# EAGLE design pirShield (EAGLE 7.2.0)
CNAME: Final Year Project; CREVISION: 1.0; DESIGNER: Adil Benabdallah
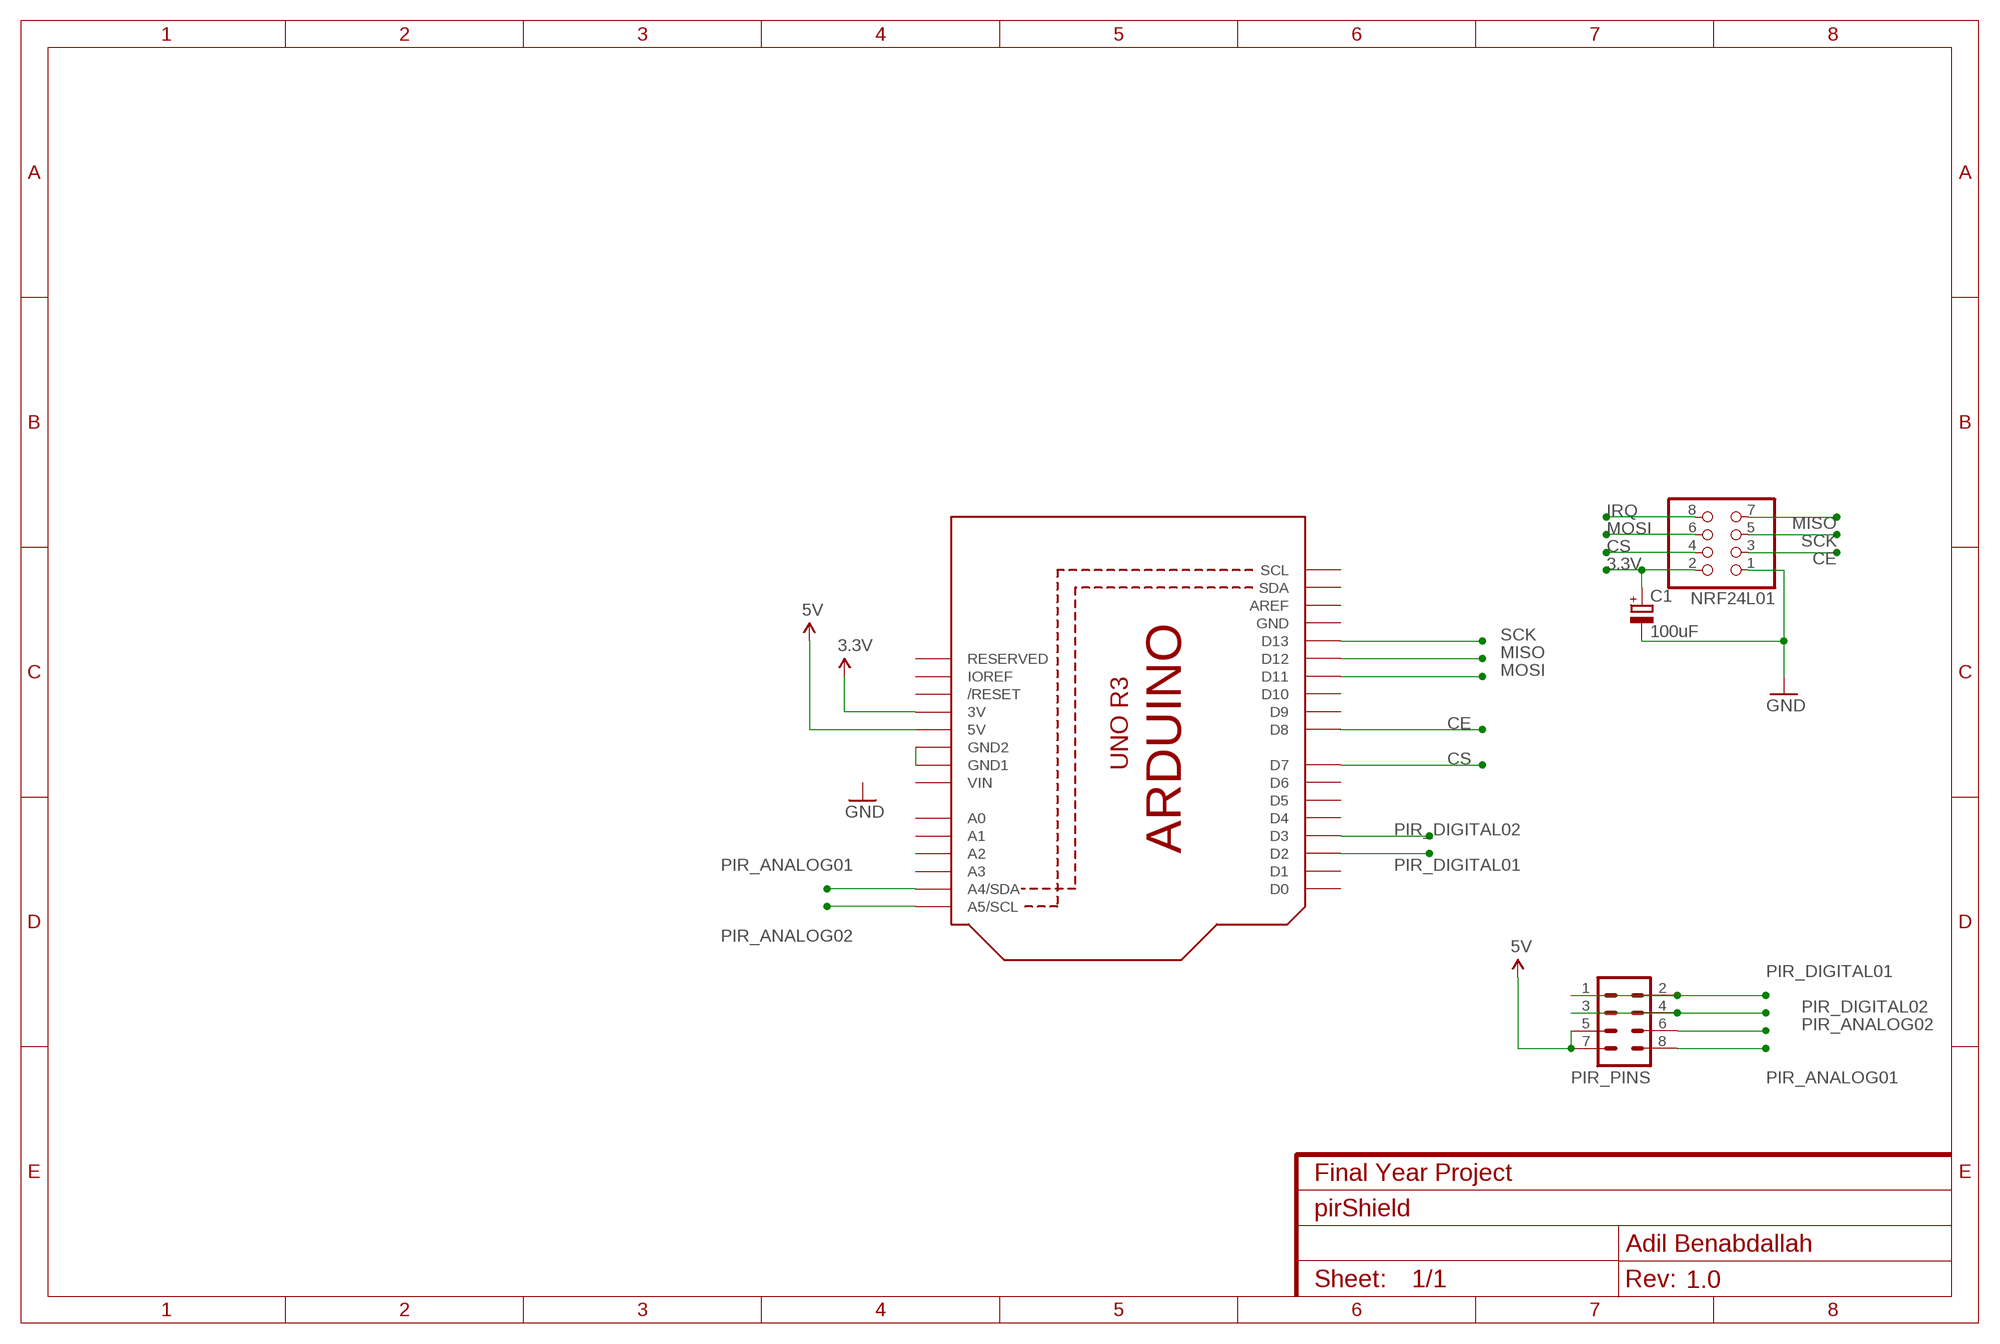
[diagram p0: schematic, sheet 1]

## Parts
C1  100uF  CPOL-EUE5-6  [E5-6]
NRF24L01  PINHD-2X4  [2X04]
PIR_PINS  MA04-2  [MA04-2]
U1  ARDUINOR3-BPLACE  [ARDUINOR3-BPLACE]

## Nets
3.3V: C1.+ NRF24L01.2 U1.3V
5V: PIR_PINS.5 PIR_PINS.7 U1.5V
CE: NRF24L01.3 U1.D8
CS: NRF24L01.4 U1.D7
GND: C1.- NRF24L01.1
IRQ: NRF24L01.8
MISO: NRF24L01.7 U1.D12
MOSI: NRF24L01.6 U1.D11
N$1: U1.GND1 U1.GND2
PIR_ANALOG01: PIR_PINS.8 U1.A4(A4/SDA)
PIR_ANALOG02: PIR_PINS.6 U1.A5(A5/SCL)
PIR_DIGITAL01: PIR_PINS.1 PIR_PINS.2 U1.D2
PIR_DIGITAL02: PIR_PINS.3 PIR_PINS.4 U1.D3
SCK: NRF24L01.5 U1.D13
Unconnected: U1.A0 U1.A1 U1.A2 U1.A3 U1.AREF U1.D0 U1.D1 U1.D4 U1.D5 U1.D6 U1.D9 U1.D10 U1.IOREF U1.RESERVED U1.RESET(/RESET) U1.SCL U1.SDA

## Power pins joined to a net without a drawn wire
GND: U1.GND
VIN: U1.VIN

## Library data of the parts
C1 = rcl:CPOL-EU: POLARIZED CAPACITOR, European symbol
NRF24L01 = pinhead:PINHD-2X4: PIN HEADER
PIR_PINS = con-lstb:MA04-2: PIN HEADER; OC_FARNELL: unknown; OC_NEWARK: unknown
U1 = adafruit:ARDUINOR3: This is a new object for the new Arduino R3 - with extra pins that you may want to use (such as IOref, and duplicated A4/A5

## Board
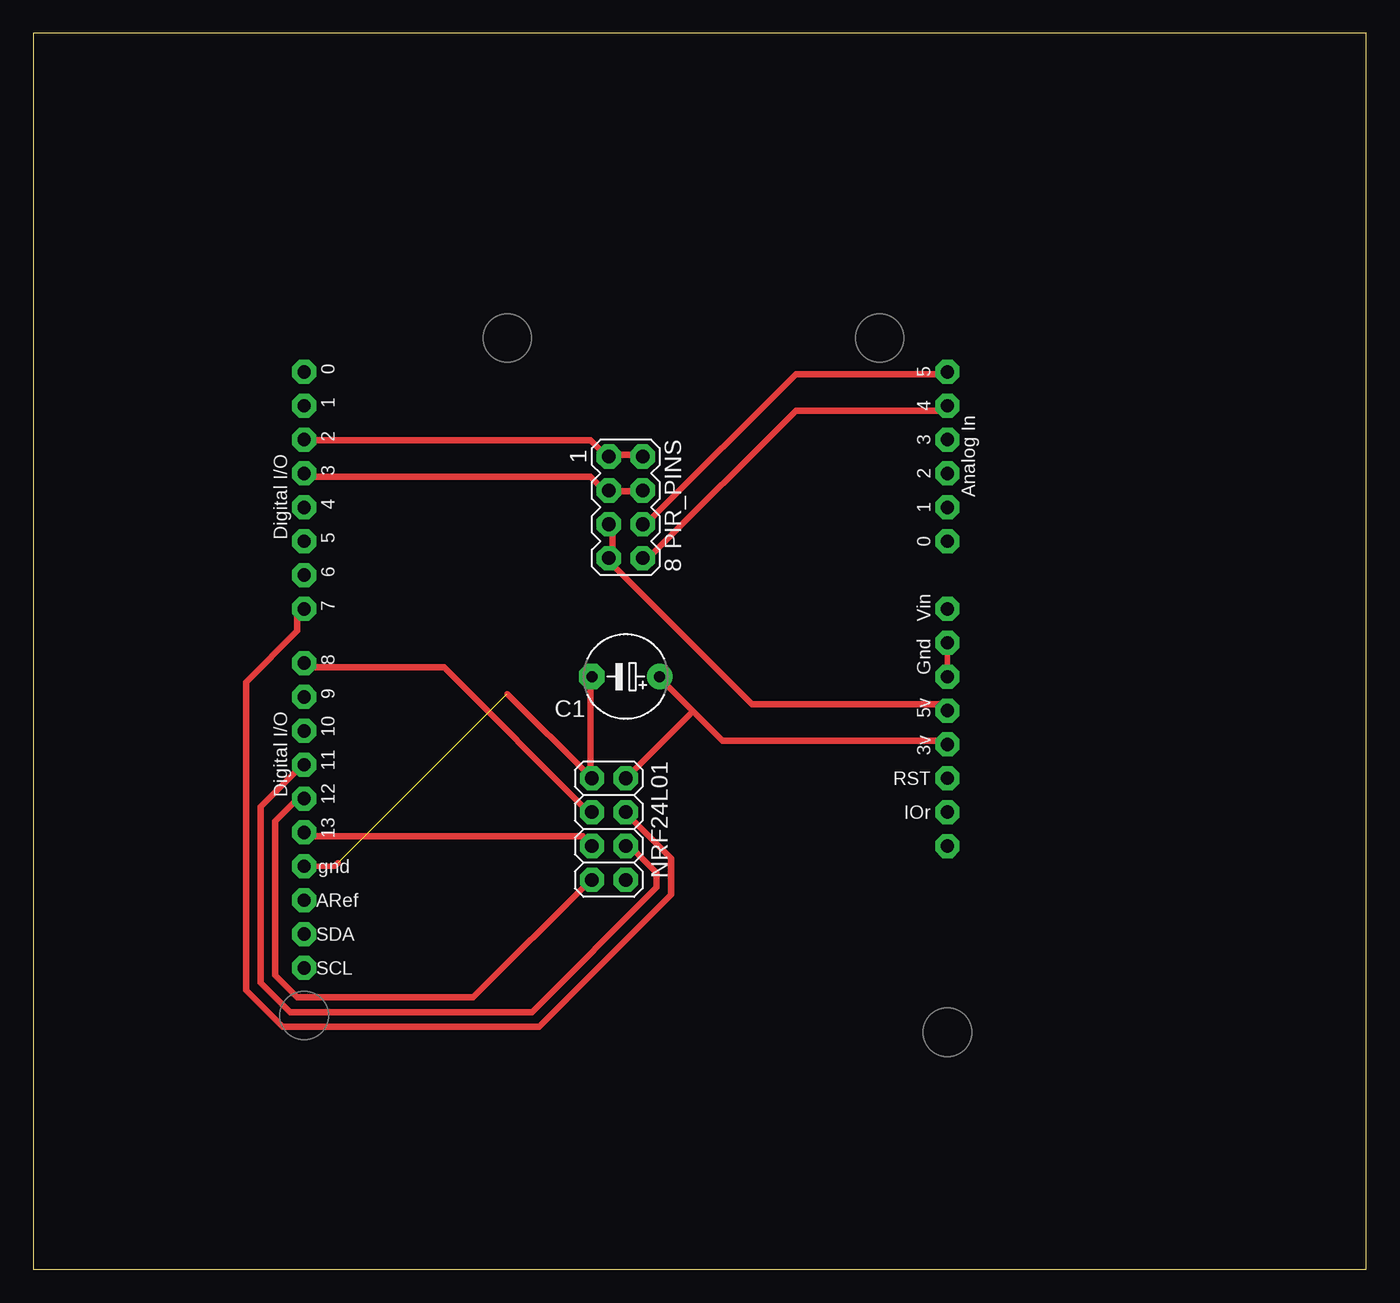
[diagram p1: board, top side]
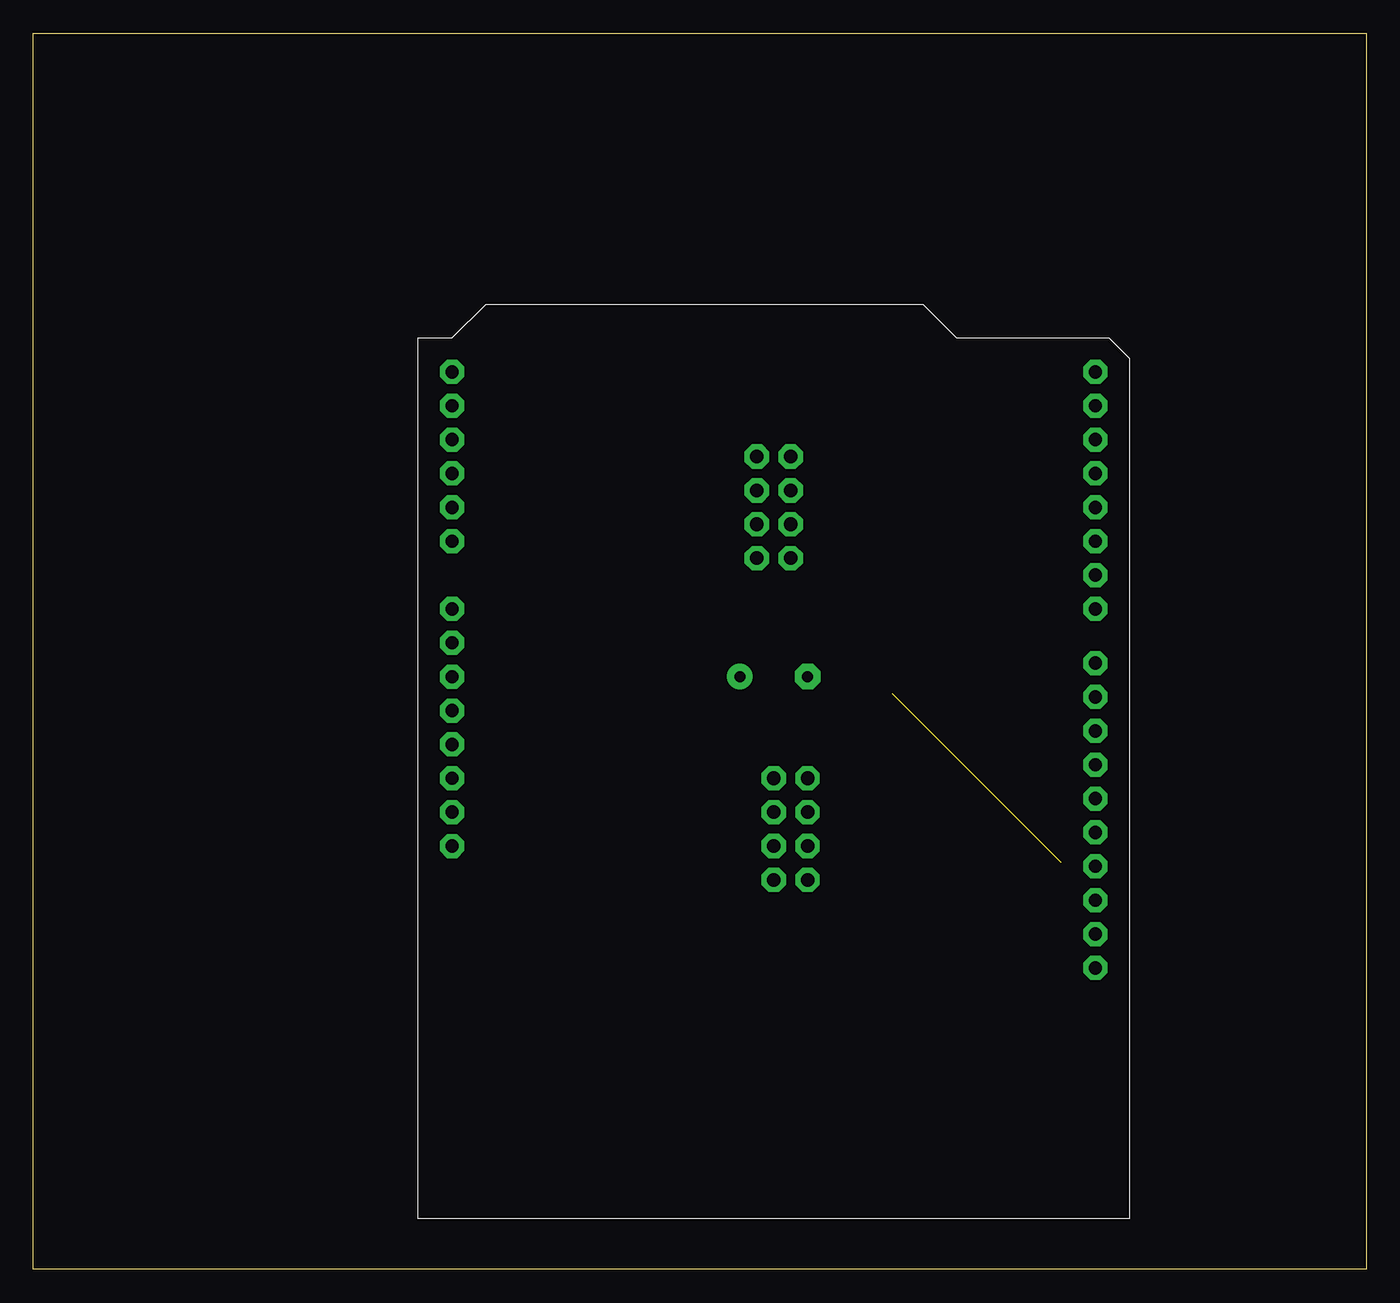
[diagram p2: board, bottom side, seen from below]

Size 100 x 92.7 mm. Coordinates in mm from the lower left corner, seen from the top.
Outline: 0,0 100,0 100,92.7 0,92.7 0,0
Copper layers (1*16): Top 0.035mm / dielectric 1.5mm / Bottom 0.035mm
Design rules "default *": minimum track width 0.5mm, minimum drill 24mil, track to track 0.6mm, track to pad 0.6mm, pad to pad 0.45mm, via to via 0.8mm, smd to smd 8mil, copper to edge 40mil, drill to drill 8mil, minimum pad ring 0.4mm, minimum via ring 0.4mm, stop-mask expansion 4mil, vias tented up to drill 0mil, thermal gap 10mil

### Footprints (pad centres in the part's own frame; a part is rotated, then mirrored left to right if it is on the bottom)
E5-6 = drill 0.813 pad 1.905: + -2.54,0 | drill 0.813 pad 1.905 octagon: - 2.54,0
2X04 = drill 1.016 octagon: 1 -3.81,-1.27; 2 -3.81,1.27; 3 -1.27,-1.27; 4 -1.27,1.27; 5 1.27,-1.27; 6 1.27,1.27; 7 3.81,-1.27; 8 3.81,1.27
MA04-2 = drill 1.016 octagon: 1 -3.81,-1.27; 2 -3.81,1.27; 3 -1.27,-1.27; 4 -1.27,1.27; 5 1.27,-1.27; 6 1.27,1.27; 7 3.81,-1.27; 8 3.81,1.27
ARDUINOR3-BPLACE = drill 1 pad 1.676 octagon: 3V 35.56,2.54; 5V 38.1,2.54; A0 50.8,2.54; A1 53.34,2.54; A2 55.88,2.54; A3 58.42,2.54; A4 60.96,2.54; A5 63.5,2.54; AREF 23.876,50.8; D0 63.5,50.8; D1 60.96,50.8; D2 58.42,50.8; D3 55.88,50.8; D4 53.34,50.8; D5 50.8,50.8; D6 48.26,50.8; D7 45.72,50.8; D8 41.656,50.8; D9 39.116,50.8; D10 36.576,50.8; D11 34.036,50.8; D12 31.496,50.8; D13 28.956,50.8; GND 26.416,50.8; GND1 43.18,2.54; GND2 40.64,2.54; IOREF 30.48,2.54; RESERVED 27.94,2.54; RESET 33.02,2.54; SCL 18.796,50.8; SDA 21.336,50.8; VIN 45.72,2.54

### Placement (x,y rotation side)
C1  44.45,44.45 180 top
NRF24L01  43.18,33.02 270 top
PIR_PINS  44.45,57.15 270 top
U1  71.12,3.81 90 top

### Tracks (layer width: path | path; a pad name or v marks a point on that pad's centre or on a via)
3.3V
  Top 0.5: 49.5,41.85 47.3,44.05 C1.+ | 49.5,41.85 51.7,39.65 68.2,39.65 U1.3V | 49.5,41.85 44.55,36.9 NRF24L01.2
5V
  Top 0.5: U1.5V 68.2,42.4 53.9,42.4 43.45,52.85 PIR_PINS.7 43.45,53.4 43.45,55.6 PIR_PINS.5
CE
  Top 0.5: U1.D8 20.35,45.15 30.8,45.15 41.8,34.15 NRF24L01.3
CS
  Top 0.5: U1.D7 19.8,49 19.8,47.9 15.95,44.05 15.95,20.95 18.7,18.2 37.95,18.2 47.85,28.1 47.85,30.85 44.55,34.15 NRF24L01.4
GND  (1 unrouted)
  Top 0.406: 41.8,36.9 41.8,36.94 35.56,43.18 | U1.GND 22.61,30.23 22.86,30.48
  Top 0.5: NRF24L01.1 41.8,36.9 41.8,44.05 C1.-
MISO
  Top 0.5: U1.D12 19.8,35.25 18.15,33.6 18.15,22.05 19.8,20.4 33,20.4 41.8,29.2 NRF24L01.7
MOSI
  Top 0.5: U1.D11 19.8,37.45 17.05,34.7 17.05,21.5 19.25,19.3 37.4,19.3 46.75,28.65 46.75,29.75 44.55,31.95 NRF24L01.6
N$1
  Top 0.406: U1.GND1 U1.GND2
PIR_ANALOG01
  Top 0.5: U1.A4 68.2,64.4 57.2,64.4 46.2,53.4 PIR_PINS.8
PIR_ANALOG02
  Top 0.5: U1.A5 68.2,67.15 57.2,67.15 46.2,56.15 PIR_PINS.6
PIR_DIGITAL01
  Top 0.5: U1.D2 20.35,62.2 41.8,62.2 42.9,61.1 PIR_PINS.1 43.45,61.1 45.65,61.1 PIR_PINS.2
PIR_DIGITAL02
  Top 0.5: U1.D3 20.35,59.45 41.8,59.45 42.9,58.35 PIR_PINS.3 43.45,58.35 45.65,58.35 PIR_PINS.4
SCK
  Top 0.5: U1.D13 20.35,32.5 41.25,32.5 41.8,31.95 NRF24L01.5